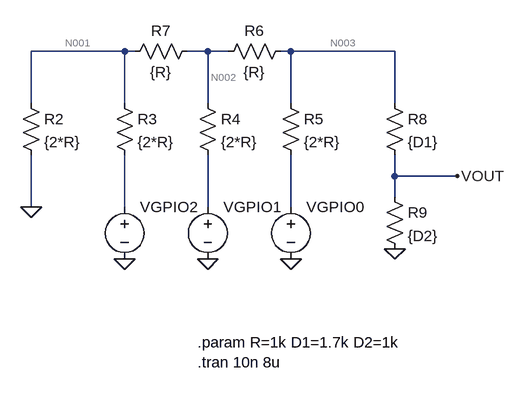
[diagram p0: schematic 3bit-ladder-dac.asc]
3bit-ladder-dac.asc, the LTspice schematic file:
Version 4
SHEET 1 880 748
WIRE 112 0 -32 0
WIRE 128 0 112 0
WIRE 240 0 208 0
WIRE 272 0 240 0
WIRE 368 0 352 0
WIRE 528 0 368 0
WIRE -32 80 -32 0
WIRE 112 80 112 0
WIRE 240 80 240 0
WIRE 368 80 368 0
WIRE 528 80 528 0
WIRE 528 192 528 160
WIRE 624 192 528 192
WIRE 528 224 528 192
WIRE -32 240 -32 160
WIRE 112 240 112 160
WIRE 240 240 240 160
WIRE 368 240 368 160
FLAG -32 240 0
FLAG 112 320 0
FLAG 240 320 0
FLAG 368 320 0
FLAG 528 304 0
FLAG 624 192 VOUT
SYMBOL res -48 64 R0
SYMATTR InstName R2
SYMATTR Value {2*R}
SYMBOL res 96 64 R0
SYMATTR InstName R3
SYMATTR Value {2*R}
SYMBOL res 224 64 R0
SYMATTR InstName R4
SYMATTR Value {2*R}
SYMBOL res 352 64 R0
SYMATTR InstName R5
SYMATTR Value {2*R}
SYMBOL res 368 -16 R90
WINDOW 0 0 56 VBottom 2
WINDOW 3 32 56 VTop 2
SYMATTR InstName R6
SYMATTR Value {R}
SYMBOL res 224 -16 R90
WINDOW 0 0 56 VBottom 2
WINDOW 3 32 56 VTop 2
SYMATTR InstName R7
SYMATTR Value {R}
SYMBOL voltage 112 224 R0
WINDOW 3 24 96 Invisible 2
SYMATTR InstName VGPIO2
SYMATTR Value PULSE(0 3.3 0 1n 1n 1u 2u)
SYMBOL voltage 240 224 R0
WINDOW 3 24 96 Invisible 2
SYMATTR InstName VGPIO1
SYMATTR Value PULSE(0 3.3 0 1n 1n 2u 4u)
SYMBOL voltage 368 224 R0
WINDOW 3 24 96 Invisible 2
SYMATTR InstName VGPIO0
SYMATTR Value PULSE(0 3.3 0 1n 1n 4u 8u)
SYMBOL Res 512 64 R0
SYMATTR InstName R8
SYMATTR Value {D1}
SYMBOL Res 512 208 R0
SYMATTR InstName R9
SYMATTR Value {D2}
TEXT 224 448 Left 2 !.param R=1k D1=1.7k D2=1k\n.tran 10n 8u

The netlist it stands for:
* 3bit-ladder-dac.asc
R2 N001 0 {2*R}
R3 N001 N004 {2*R}
R4 N002 N005 {2*R}
R5 N003 N006 {2*R}
R6 N003 N002 {R}
R7 N002 N001 {R}
VGPIO2 N004 0 PULSE(0 3.3 0 1n 1n 1u 2u)
VGPIO1 N005 0 PULSE(0 3.3 0 1n 1n 2u 4u)
VGPIO0 N006 0 PULSE(0 3.3 0 1n 1n 4u 8u)
R8 N003 VOUT {D1}
R9 VOUT 0 {D2}
.param R=1k D1=1.7k D2=1k
.tran 10n 8u
.backanno
.end

* Results of the author's LTspice run, read from the files saved beside the schematic
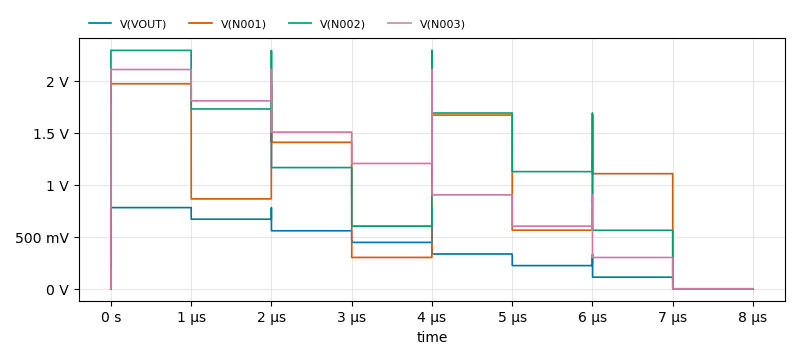
[diagram p1: Transient Analysis of 3bit-ladder-dac.asc, plotted from the saved traces]
* Transient Analysis, 1 run:
*   V(VOUT): min 0 V, max 780.4 mV, average 390.4 mV, rms 466.5 mV, last 0 V
*   V(N001): min 0 V, max 1.971 V, average 986 mV, rms 1.175 V, last 0 V
*   V(N002): min 0 V, max 2.291 V, average 1.146 V, rms 1.342 V, last 0 V
*   V(N003): min 0 V, max 2.107 V, average 1.054 V, rms 1.26 V, last 0 V